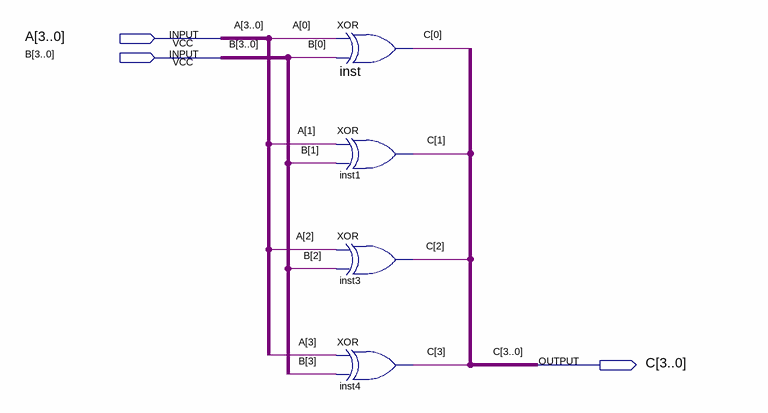
[diagram p0: schematic sheet]
// Quartus schematic xor4impl.bdf as structural Verilog: 4 symbols, 3 pins
module xor4impl (
  input  [3:0] A,
  input  [3:0] B,
  output [3:0] C
);

  xor inst (C[0], A[0], B[0]);
  xor inst1 (C[1], A[1], B[1]);
  xor inst3 (C[2], A[2], B[2]);
  xor inst4 (C[3], A[3], B[3]);
endmodule
